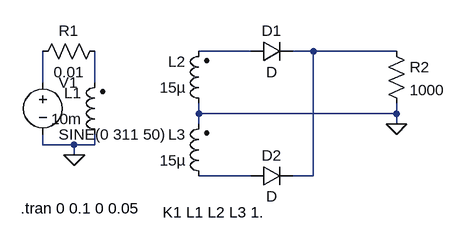
[diagram p0: schematic Retificador_onda_completa.asc]
Retificador_onda_completa.asc, the LTspice schematic file:
Version 4
SHEET 1 880 680
WIRE 304 16 224 16
WIRE 400 16 368 16
WIRE 528 16 400 16
WIRE -16 64 -16 16
WIRE 64 64 64 16
WIRE 224 112 224 96
WIRE 528 112 528 96
WIRE 528 112 224 112
WIRE 224 128 224 112
WIRE 528 128 528 112
WIRE -16 160 -16 144
WIRE 32 160 -16 160
WIRE 64 160 64 144
WIRE 64 160 32 160
WIRE 32 176 32 160
WIRE 304 208 224 208
WIRE 400 208 400 16
WIRE 400 208 368 208
FLAG 32 176 0
FLAG 528 128 0
SYMBOL ind2 240 112 R180
WINDOW 0 36 80 Left 2
WINDOW 3 36 40 Left 2
SYMATTR InstName L2
SYMATTR Value 15µ
SYMBOL ind2 240 224 R180
WINDOW 0 36 80 Left 2
WINDOW 3 36 40 Left 2
SYMATTR InstName L3
SYMATTR Value 15µ
SYMBOL res 80 0 R90
WINDOW 0 0 56 VBottom 2
WINDOW 3 32 56 VTop 2
SYMATTR InstName R1
SYMATTR Value 0.01
SYMBOL voltage -16 48 R0
WINDOW 123 0 0 Left 0
WINDOW 39 0 0 Left 0
SYMATTR InstName V1
SYMATTR Value SINE(0 311 50)
SYMBOL diode 304 32 R270
WINDOW 0 32 32 VTop 2
WINDOW 3 0 32 VBottom 2
SYMATTR InstName D1
SYMBOL diode 304 224 R270
WINDOW 0 32 32 VTop 2
WINDOW 3 0 32 VBottom 2
SYMATTR InstName D2
SYMBOL res 512 0 R0
SYMATTR InstName R2
SYMATTR Value 1000
SYMBOL ind2 80 160 R180
WINDOW 0 36 80 Left 2
WINDOW 3 36 40 Left 2
SYMATTR InstName L1
SYMATTR Value 10m
TEXT -50 258 Left 2 !.tran 0 0.1 0 0.05
TEXT 168 264 Left 2 !K1 L1 L2 L3 1.

The netlist it stands for:
* Retificador_onda_completa.asc
L2 0 N001 15µ
L3 N005 0 15µ
R1 N004 N003 0.01
V1 N003 0 SINE(0 311 50)
D1 N001 N002 D
D2 N005 N002 D
R2 N002 0 1000
L1 0 N004 10m
.model D D
.lib standard.dio
.tran 0 0.1 0 0.05
K1 L1 L2 L3 1.
.backanno
.end